# EAGLE design WifiTracker (EAGLE 9.3.2)
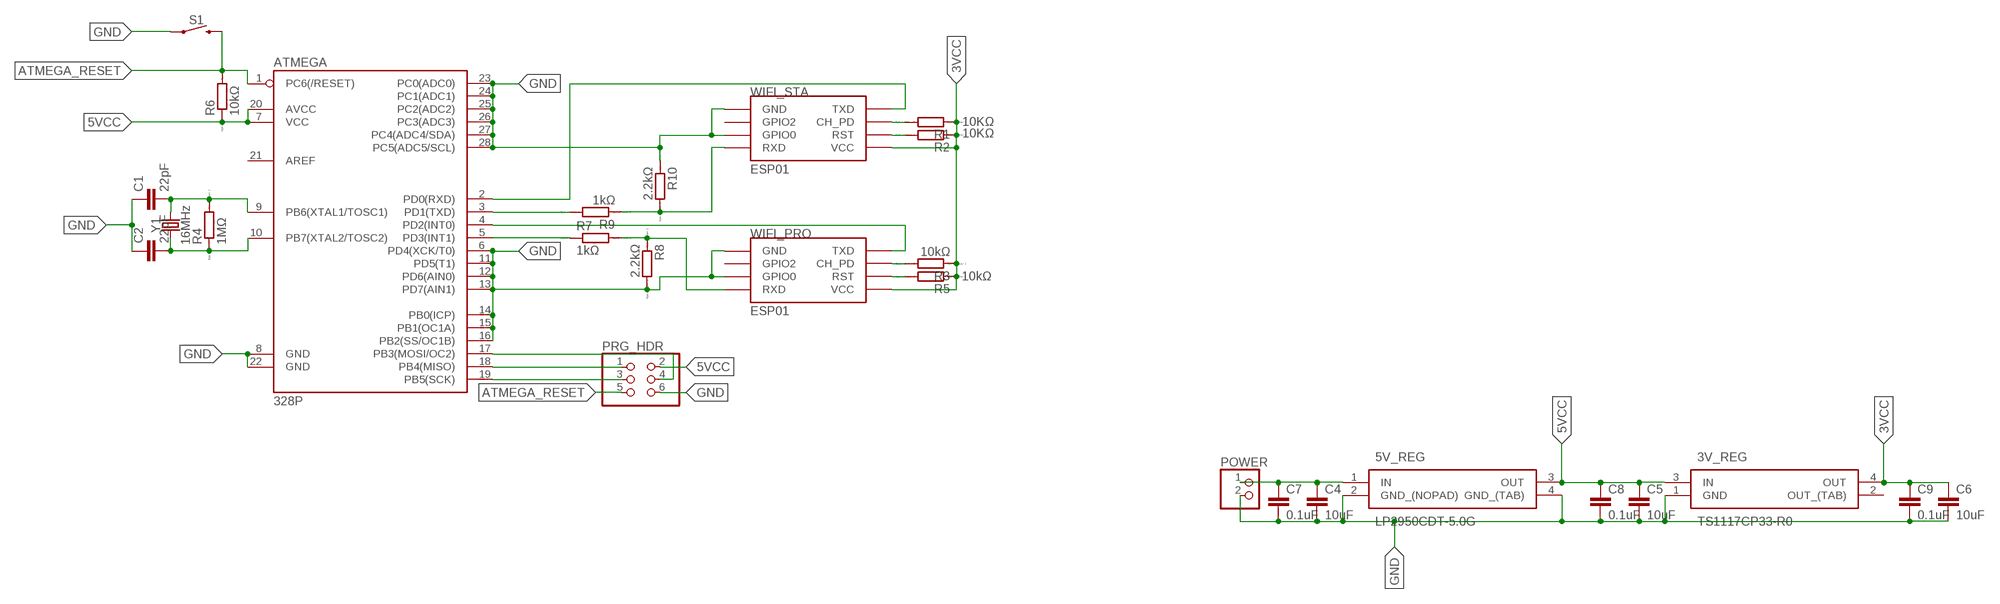
[diagram p0: schematic, sheet 1]

## Parts
3V_REG  TS1117CP33-R0  [TO229P990X238-4N]
5V_REG  LP2950CDT-5.0G  [TO229P990X238-4N]
ATMEGA  328P  ATMEGA328P_PDIP  [DIP28]
C1  22pF  1.0UF-1206-50V-10%  [1206]
C2  22pF  1.0UF-1206-50V-10%  [1206]
C4  10uF  1.0UF-1206-50V-10%  [1206]
C5  10uF  1.0UF-1206-50V-10%  [1206]
C6  10uF  1.0UF-1206-50V-10%  [1206]
C7  0.1uF  1.0UF-1206-50V-10%  [1206]
C8  0.1uF  1.0UF-1206-50V-10%  [1206]
C9  0.1uF  1.0UF-1206-50V-10%  [1206]
POWER  PINHD-1X2  [1X02]
PRG_HDR  PINHD-2X3  [2X03]
R1  10KΩ  RR1210  [R1210]
R2  10KΩ  RR1210  [R1210]
R3  10kΩ  RR1210  [R1210]
R4  1MΩ  RR1210  [R1210]
R5  10kΩ  RR1210  [R1210]
R6  10kΩ  RR1210  [R1210]
R7  1kΩ  RR1210  [R1210]
R8  2.2kΩ  RR1210  [R1210]
R9  1kΩ  RR1210  [R1210]
R10  2.2kΩ  RR1210  [R1210]
S1  MOMENTARY-SWITCH-SPST-PTH-6.0MM  [TACTILE_SWITCH_PTH_6.0MM]
WIFI_PRO  ESP01  [ESP01]
WIFI_STA  ESP01  [ESP01]
Y1  16MHz  CRYSTAL-8MHZSMD-HC49UP  [HC49UP]

## Nets
3VCC [power]: 3V_REG.4(OUT) C6.1 C9.1 R1.1 R2.1 R3.1 R5.1 WIFI_PRO.VCC WIFI_STA.VCC
5VCC [power]: 3V_REG.3(IN) 5V_REG.3(OUT) ATMEGA.7(VCC) ATMEGA.20(AVCC) C5.1 C8.1 PRG_HDR.2 R6.1
AT_STXD: ATMEGA.5(PD3(INT1)) R7.1
AT_TXD: ATMEGA.3(PD1(TXD)) R9.2
ATMEGA_RESET: ATMEGA.1(PC6(/RESET)) PRG_HDR.5 R6.2 S1.3
GND [power]: 3V_REG.1(GND) 5V_REG.2(GND_(NOPAD)) 5V_REG.4(GND_(TAB)) ATMEGA.6(PD4(XCK/T0)) ATMEGA.8(GND) ATMEGA.11(PD5(T1)) ATMEGA.12(PD6(AIN0)) ATMEGA.13(PD7(AIN1)) ATMEGA.14(PB0(ICP)) ATMEGA.15(PB1(OC1A)) ATMEGA.16(PB2(SS/OC1B)) ATMEGA.22(GND) ATMEGA.23(PC0(ADC0)) ATMEGA.24(PC1(ADC1)) ATMEGA.25(PC2(ADC2)) ATMEGA.26(PC3(ADC3)) ATMEGA.27(PC4(ADC4/SDA)) ATMEGA.28(PC5(ADC5/SCL)) C1.1 C2.1 C4.2 C5.2 C6.2 C7.2 C8.2 C9.2 POWER.2 PRG_HDR.6 R8.2 R10.1 S1.1 WIFI_PRO.GND WIFI_PRO.GPIO0 WIFI_STA.GND WIFI_STA.GPIO0
MISO: ATMEGA.18(PB4(MISO)) PRG_HDR.1
MOSI: ATMEGA.17(PB3(MOSI/OC2)) PRG_HDR.4
PRO_CH_PD: R3.2 WIFI_PRO.CH_PD
PRO_RST: R5.2 WIFI_PRO.RST
PRO_RXD: R7.2 R8.1 WIFI_PRO.RX(RXD)
PRO_TXD: ATMEGA.4(PD2(INT0)) WIFI_PRO.TX(TXD)
SCK: ATMEGA.19(PB5(SCK)) PRG_HDR.3
STA_CH_PD: R1.2 WIFI_STA.CH_PD
STA_RST: R2.2 WIFI_STA.RST
STA_RXD: R9.1 R10.2 WIFI_STA.RX(RXD)
STA_TXD: ATMEGA.2(PD0(RXD)) WIFI_STA.TX(TXD)
VIN [power]: 5V_REG.1(IN) C4.1 C7.1 POWER.1
XTAL1: ATMEGA.9(PB6(XTAL1/TOSC1)) C1.2 R4.2 Y1.2
XTAL2: ATMEGA.10(PB7(XTAL2/TOSC2)) C2.2 R4.1 Y1.1
Unconnected: 3V_REG.2(OUT_(TAB)) ATMEGA.21(AREF) WIFI_PRO.GPIO2 WIFI_STA.GPIO2

## Library data of the parts
3V_REG = TS1117CP33-R0:TS1117CP33-R0: Source: Datasheet <http://www.onsemi.com/pub/Collateral/LP2950-D.PDF>; ALLIED_NUMBER: 70100442; ALLIED_PRICE-STOCK: http://www.alliedelec.com/on-semiconductor-lp2950cdt-5-0g/70100442/; HEIGHT: 2.38mm; MANUFACTURER_NAME: ON Semiconductor; MANUFACTURER_PART_NUMBER: LP2950CDT-5.0G; MOUSER_PART_NUMBER: 863-LP2950CDT-5.0G; MOUSER_PRICE-STOCK: https://www.mouser.com/Search/Refine.aspx?Keyword=863-LP2950CDT-5.0G; RS_PART_NUMBER: 0463593P; RS_PRICE-STOCK: http://uk.rs-online.com/web/p/products/0463593P
5V_REG = LP2950CDT-5.0G:LP2950CDT-5.0G: Source: Datasheet <http://www.onsemi.com/pub/Collateral/LP2950-D.PDF>; ALLIED_NUMBER: 70100442; ALLIED_PRICE-STOCK: http://www.alliedelec.com/on-semiconductor-lp2950cdt-5-0g/70100442/; HEIGHT: 2.38mm; MANUFACTURER_NAME: ON Semiconductor; MANUFACTURER_PART_NUMBER: LP2950CDT-5.0G; MOUSER_PART_NUMBER: 863-LP2950CDT-5.0G; MOUSER_PRICE-STOCK: https://www.mouser.com/Search/Refine.aspx?Keyword=863-LP2950CDT-5.0G; RS_PART_NUMBER: 0463593P; RS_PRICE-STOCK: http://uk.rs-online.com/web/p/products/0463593P
ATMEGA = SparkFun-IC-Microcontroller:ATMEGA328P_PDIP: Atmel 328P Through hole ATMEGA328P uC used in the Arduino 32kb flash, 1k EEPROM, 2k SRAM Datasheet <http://www.sparkfun.com/datasheets/Components/SMD/ATMega328.pdf> SparkFun Products Storefront component: AVR 28 Pin 20MHz 32K 6A/D - ATMega328P <https://www.sparkfun.com/products/9061> (COM-09061) SparkFun Simon Says - Through-Hole Soldering Kit <https://www.sparkfun.com/products/10547> (KIT-10547) SparkFun Learn to Solder - Simon Says <https://www.sparkfun.com/products/13708> (KIT-13708) SparkFun BigTime Watch Kit <https://www.sparkfun.com/products/11734> (KIT-11734) SparkFun ClockIt <https://www.sparkfun.com/products/10930> (KIT-10930) SparkFun Serial Enabled LCD Kit <https://www.sparkfun.com/products/10097> (LCD-10097) SparkFun Simon Tilts - Through Hole Soldering Kit <https://www.sparkfun.com/products/12634> (KIT-12634) SparkFun Frequency Counter Kit <https://www.sparkfun.com/products/10140> (KIT-10140) FabFM Radio Kit <https://www.sparkfun.com/products/11043> (KIT-11043) SparkFun Binary Blaster Kit <https://www.sparkfun.com/products/12037> (KIT-12037) SparkFun Metro-Gnome <https://www.sparkfun.com/products/9236> (KIT-09236) ATmega328 with Arduino Optiboot (Uno) <https://www.sparkfun.com/products/10524> (DEV-10524); PROD_ID: IC-09136
C1 C2 C4-C9 = SparkFun-Capacitors:1.0UF: 1µF ceramic capacitors A capacitor is a passive two-terminal electrical component used to store electrical energy temporarily in an electric field.; PROD_ID: CAP-09822; VALUE: 1.0uF
POWER = pinhead:PINHD-1X2: PIN HEADER
PRG_HDR = pinhead:PINHD-2X3: PIN HEADER
R1-R10 = eagle-ltspice:R: RESISTOR, European symbol; SPICEMODEL: NONE; SPICEPREFIX: R
S1 = SparkFun-Switches:MOMENTARY-SWITCH-SPST: Momentary Switch (Pushbutton) - SPST Normally-open (NO) SPST momentary switches (buttons, pushbuttons). Variants PTH-12MM - 12mm square, through-hole Momentary Pushbutton Switch - 12mm Square <https://www.sparkfun.com/products/9190> (COM-09190) PTH-6.0MM, PTH-6.0MM-KIT - 6.0mm square, through-hole Mini Pushbutton Switch <https://www.sparkfun.com/products/97> (COM-00097) KIT package intended for soldering kit's - only one side of pads' copper is exposed. PTH-RIGHT-ANGLE-KIT - Right-angle, through-hole Right Angle Tactile Button <https://www.sparkfun.com/products/10791> - Used on SparkFun BigTime Watch Kit <https://www.sparkfun.com/products/11734> SMD-12MM - 12mm square, surface-mount Tactile Button - SMD (12mm) <https://www.sparkfun.com/products/12993> (COM-12993) Used on SparkFun PicoBoard <https://www.sparkfun.com/products/11888> SMD-4.5MM - 4.5mm Square Trackball Switch Used on SparkFun Blackberry Trackballer Breakout <https://www.sparkfun.com/products/13169> SMD-4.6MMX2.8MM - 4.60mm x 2.80mm, surface mount Used on SparkFun SAMD21 Mini Breakout <https://www.sparkfun.com/products/13664> SMD-5.2MM, SMD-5.2-REDUNDANT - 5.2mm square, surface-mount Mini Pushbutton Switch - SMD <https://www.sparkfun.com/products/8720> (COM-08720) Used on Arduino Pro Mini <https://www.sparkfun.com/products/11114> REDUNDANT package connects both switch circuits together SMD-6.0X3.5MM - 6.0 x 3.5mm, surface mount Momentary Reset Switch SMD <https://www.sparkfun.com/products/8229> (COM-08229) SMD-6.2MM-TALL - 6.2mm square, surface mount Tactile Button - SMD (6mm) <https://www.sparkfun.com/products/12992> Used on SparkFun Digital Sandbox <https://www.sparkfun.com/products/12651> SMD-RIGHT-ANGLE - Right-angle, surface mount Used on SparkFun Block for Intel® Edison - Arduino <https://www.sparkfun.com/products/13036>; PROD_ID: SWCH-08441; SF_SKU: COM-00097
WIFI_PRO WIFI_STA = esp8266modules:ESP01: ESP8266 Wifi module 01
Y1 = SparkFun-Clocks:CRYSTAL-8MHZ: 8MHz Crystal Datasheet Example <http://www.futureelectronics.com/en/technologies/electromechanical/timing-devices/crystals/Pages/6008189-ABM3B-8.000MHZ-B2-T.aspx?IM=0> Frequency: 8MHz Frequency Tolerance: ±20ppm Load Capacitance: 18pF SparkFun Products: Pro Micro -3.3V/8MHz <https://www.sparkfun.com/products/12587> WAV Trigger <https://www.sparkfun.com/products/13660>; PROD_ID: XTAL-11706; VALUE: 8MHz

## Net classes
0 default: width 0.406 mm, drill 0.203 mm, clearance 0.203 mm
1 power: width 0.813 mm, drill 0.203 mm, clearance 0.203 mm
2 text: width 0.203 mm, drill 0.203 mm, clearance 0.203 mm

## Board
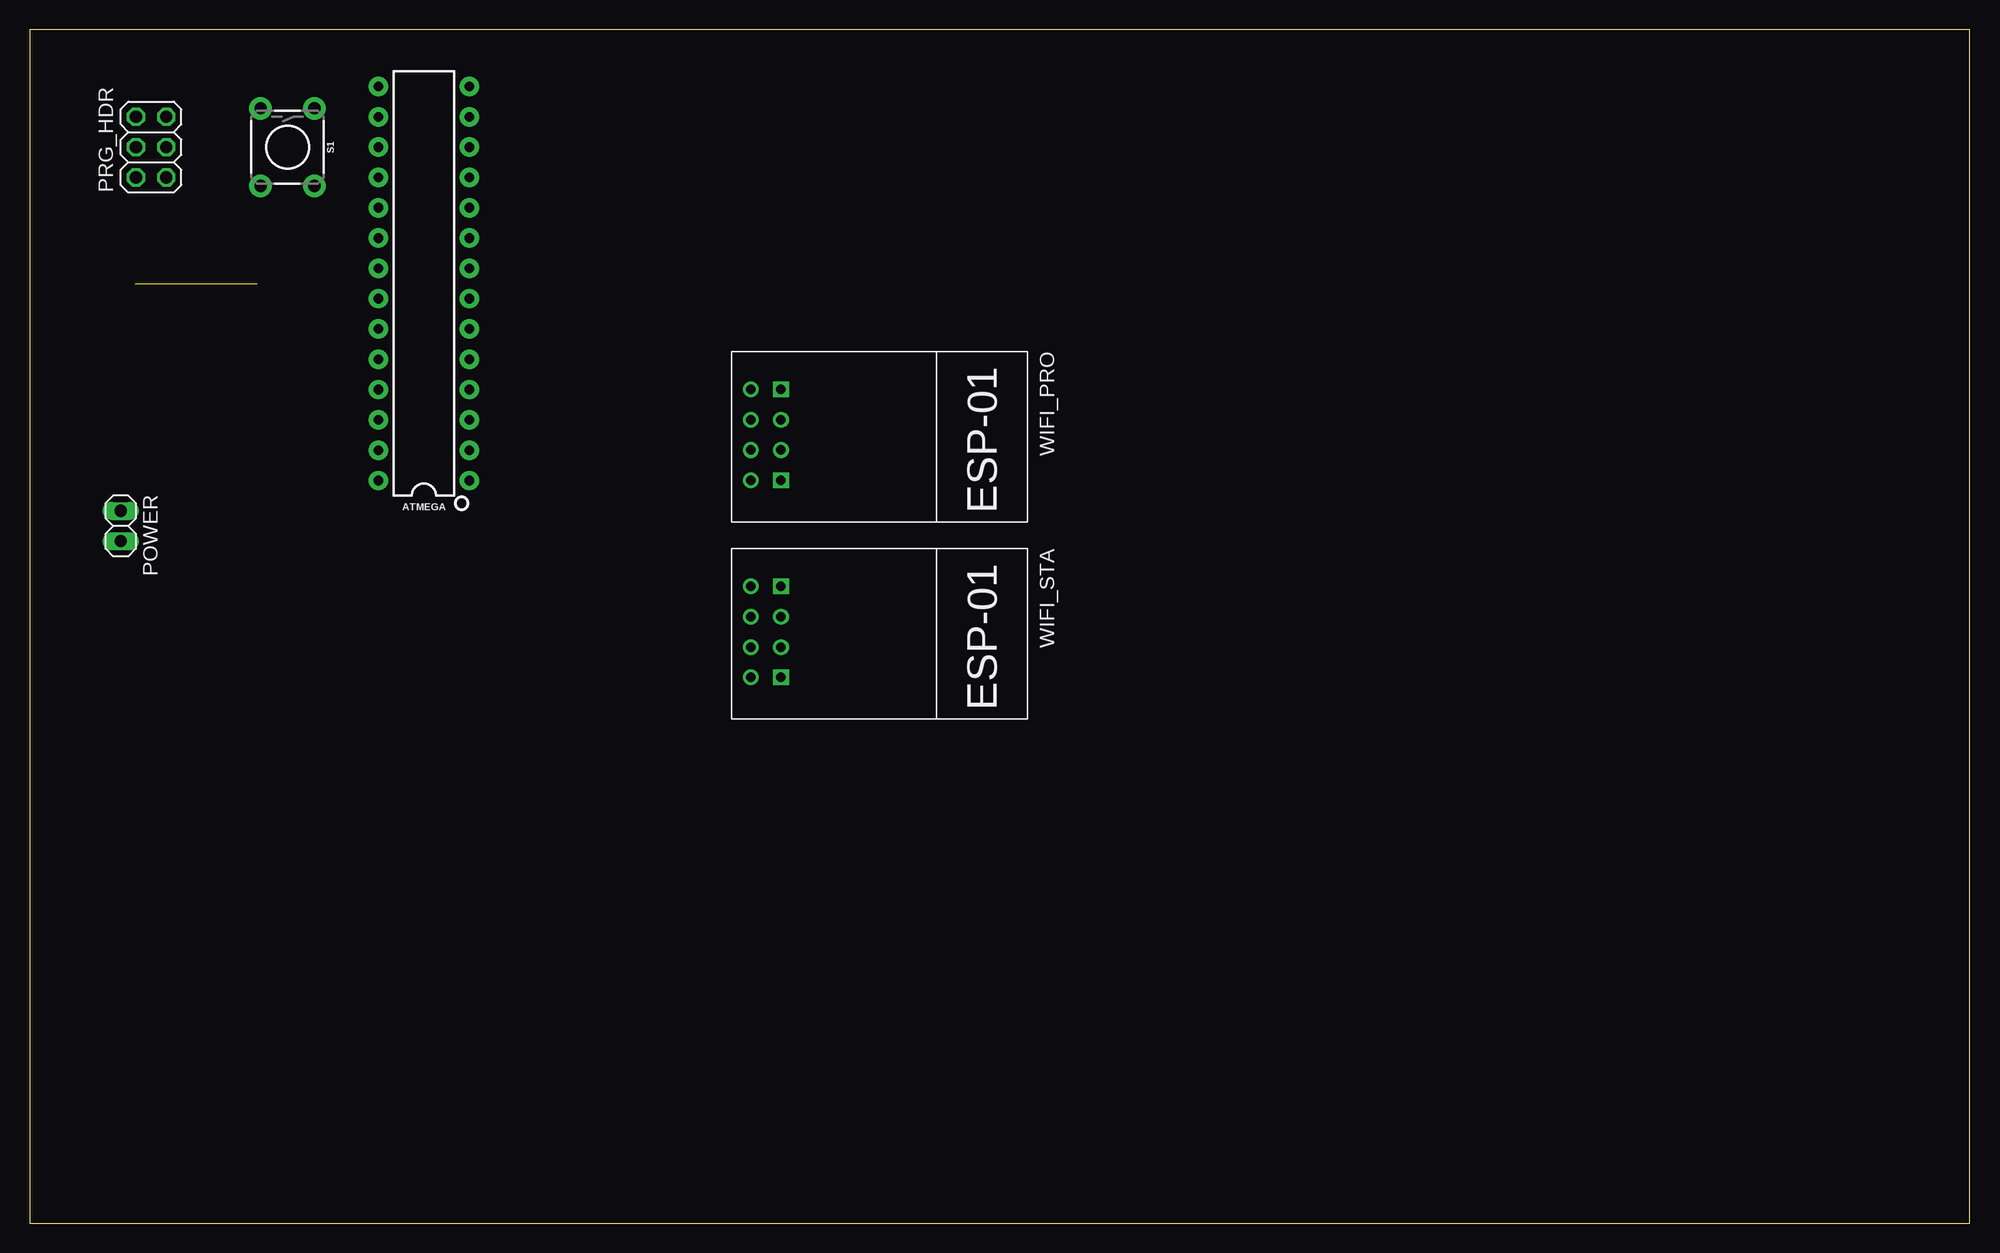
[diagram p1: board, top side]
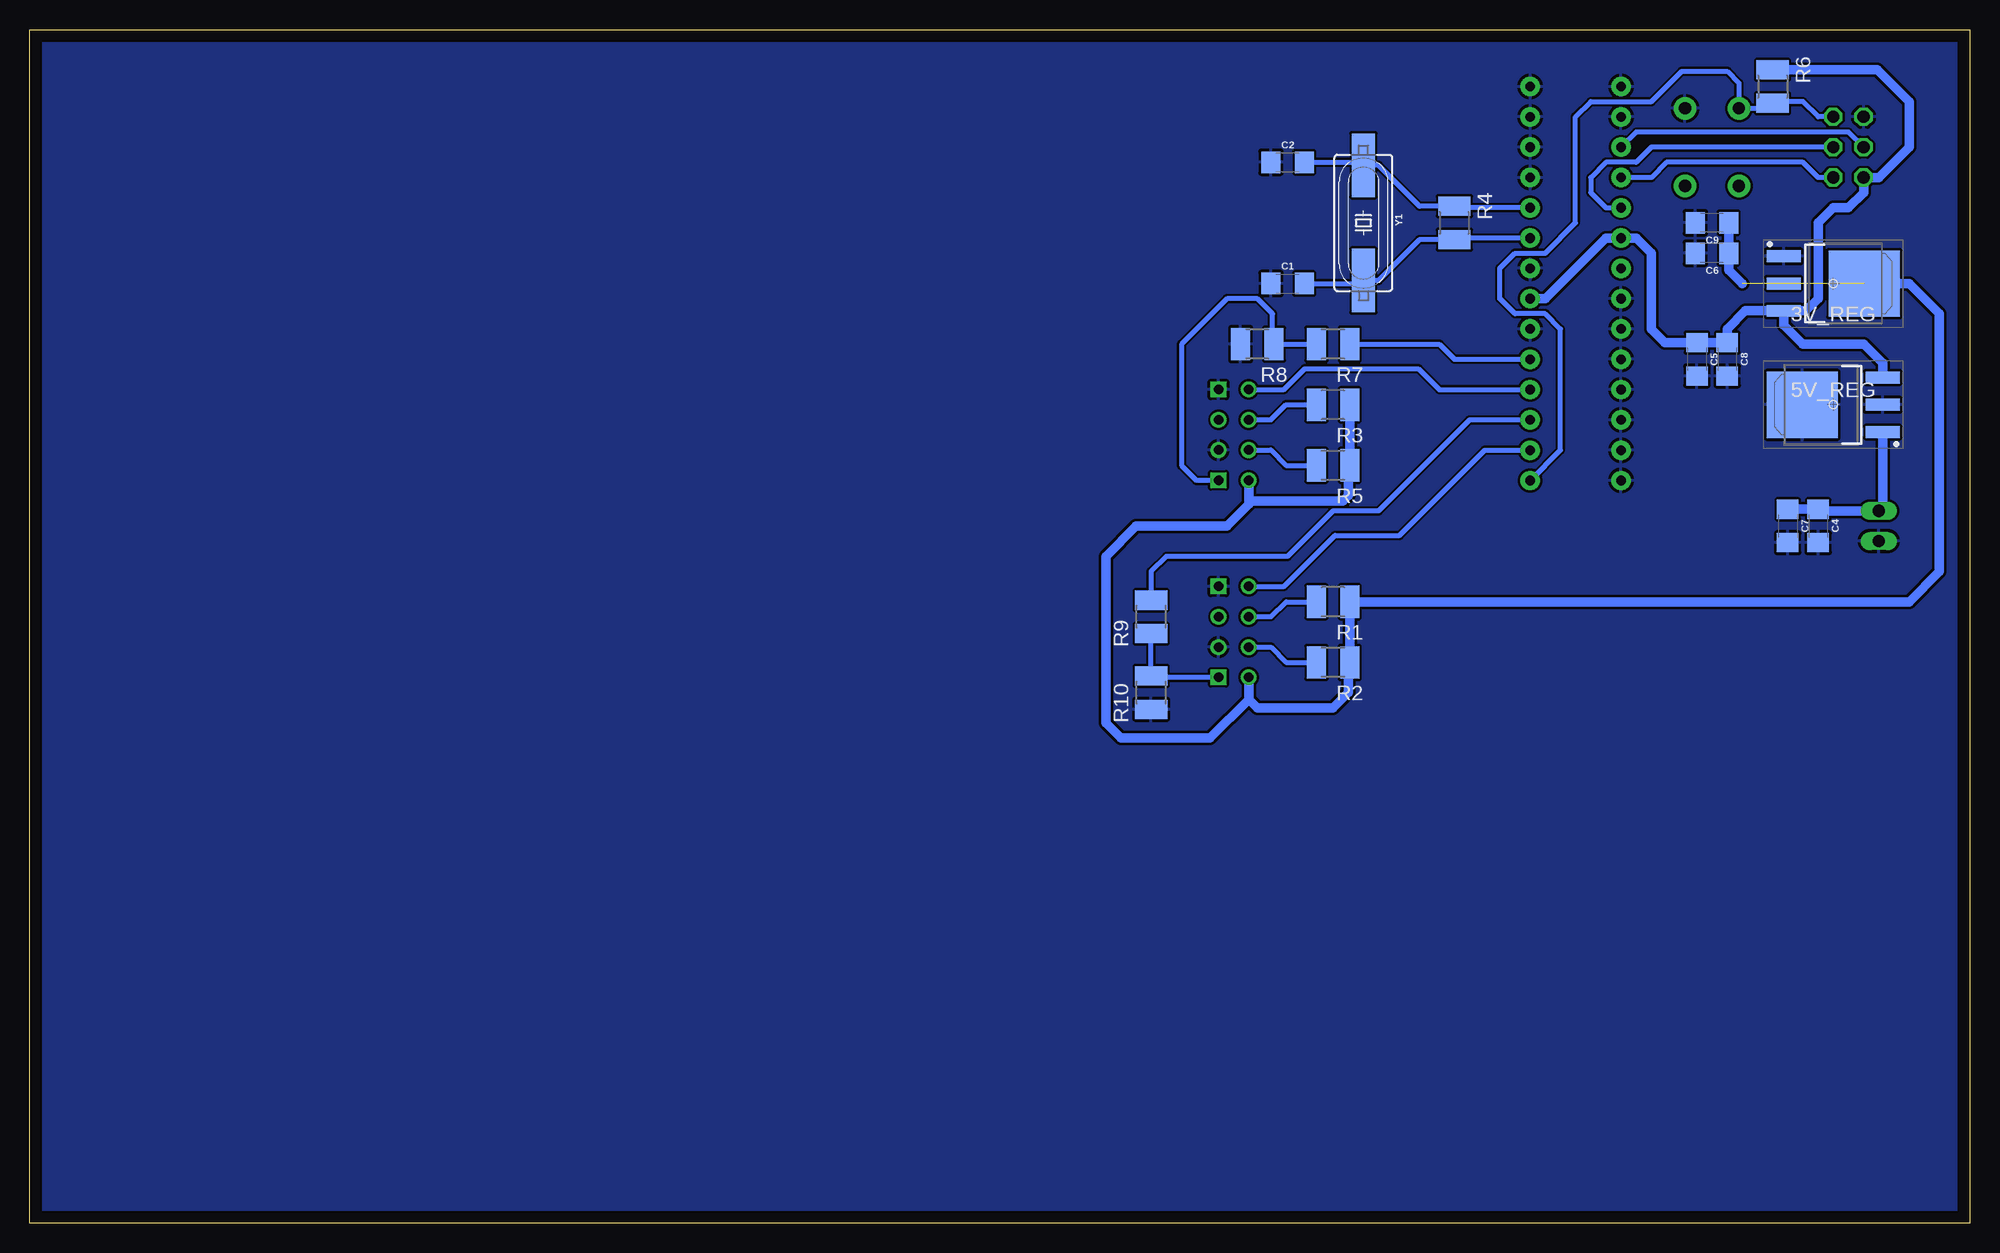
[diagram p2: board, bottom side, seen from below]

Size 162.54 x 100 mm. Coordinates in mm from the lower left corner, seen from the top.
Outline: 0,0 162.54,0 162.54,100 0,100 0,0
Copper layers (1*16): Top 0.035mm / dielectric 1.5mm / Bottom 0.035mm
Design rules "default": minimum track width 6mil, minimum drill 0.35mm, track to track 6mil, track to pad 6mil, pad to pad 6mil, via to via 6mil, smd to smd 6mil, copper to edge 40mil, drill to drill 6mil, minimum pad ring 10mil, minimum via ring 8mil, stop-mask expansion 4mil, vias tented up to drill 0mil, thermal gap 10mil

### Footprints (pad centres in the part's own frame; a part is rotated, then mirrored left to right if it is on the bottom)
TO229P990X238-4N = smd 2.85 x 1: 1 -4.15,2.29; 2 -4.15,0; 3 -4.15,-2.29 | smd 5.95 x 5.55: 4 2.6,0
DIP28 = drill 0.813 pad 1.626: 1 -16.51,-3.81; 2 -13.97,-3.81; 3 -11.43,-3.81; 4 -8.89,-3.81; 5 -6.35,-3.81; 6 -3.81,-3.81; 7 -1.27,-3.81; 8 1.27,-3.81; 9 3.81,-3.81; 10 6.35,-3.81; 11 8.89,-3.81; 12 11.43,-3.81; 13 13.97,-3.81; 14 16.51,-3.81; 15 16.51,3.81; 16 13.97,3.81; 17 11.43,3.81; 18 8.89,3.81; 19 6.35,3.81; 20 3.81,3.81; 21 1.27,3.81; 22 -1.27,3.81; 23 -3.81,3.81; 24 -6.35,3.81; 25 -8.89,3.81; 26 -11.43,3.81; 27 -13.97,3.81; 28 -16.51,3.81
1206 = smd 1.6 x 1.8: 1 -1.4,0; 2 1.4,0
1X02 = drill 1.016 long: 1 -1.27,0; 2 1.27,0
2X03 = drill 1.016 octagon: 1 -2.54,-1.27; 2 -2.54,1.27; 3 0,-1.27; 4 0,1.27; 5 2.54,-1.27; 6 2.54,1.27
R1210 = smd 1.6 x 2.7: 1 -1.4,0; 2 1.4,0
TACTILE_SWITCH_PTH_6.0MM = drill 1.016 pad 1.88: 1 -3.251,2.261; 2 3.251,2.261; 3 -3.251,-2.261; 4 3.251,-2.261
ESP01 = drill 0.8: CH_PD -1.285,-8.178; GPIO0 1.255,-5.638; GPIO2 -1.285,-5.638; RST 1.255,-8.178; TX -3.825,-8.178; VCC 3.795,-8.178 | drill 0.8 square: GND -3.825,-5.638; RX 3.795,-5.638
HC49UP = smd 5.334 x 1.93: 1 -4.826,0; 2 4.826,0

### Placement (x,y rotation side)
3V_REG  11.43,78.74 0 bottom
5V_REG  11.43,68.58 180 bottom
ATMEGA  33.02,78.74 90 top
C1  57.15,78.74 0 bottom
C2  57.15,88.9 0 bottom
C4  12.7,58.42 270 bottom
C5  22.86,72.39 270 bottom
C6  21.59,81.28 180 bottom
C7  15.24,58.42 270 bottom
C8  20.32,72.39 270 bottom
C9  21.59,83.82 180 bottom
POWER  7.62,58.42 270 top
PRG_HDR  10.16,90.17 90 top
R1  53.34,52.07 180 bottom
R2  53.34,46.99 180 bottom
R3  53.34,68.58 180 bottom
R4  43.18,83.82 270 bottom
R5  53.34,63.5 180 bottom
R6  16.51,95.25 270 bottom
R7  53.34,73.66 180 bottom
R8  59.69,73.66 180 bottom
R9  68.58,50.8 90 bottom
R10  68.58,44.45 90 bottom
S1  21.59,90.17 270 top
WIFI_PRO  68.58,66.04 270 top
WIFI_STA  68.58,49.53 270 top
Y1  50.8,83.82 270 bottom

### Tracks (layer width: path | path; a pad name or v marks a point on that pad's centre or on a via)
3VCC  (1 unrouted)
  Bottom 0.813: 19.05,78.74 20.19,79.88 C6.1 C9.1 | 3V_REG.4 5.08,78.74 2.54,76.2 2.54,54.61 5.08,52.07 R1.1 R2.1 52.07,46.86 52.07,44.45 53.34,43.18 59.69,43.18 60.4,43.89 | WIFI_STA.VCC 60.4,43.89 | 60.4,43.89 63.66,40.64 71.12,40.64 72.39,41.91 72.39,55.88 69.85,58.42 62.23,58.42 60.4,60.25 | 60.4,60.25 WIFI_PRO.VCC | 60.4,60.25 60.15,60.5 52.53,60.5 52.07,60.96 52.07,63.37 R5.1 R3.1
5VCC
  Bottom 0.813: 3V_REG.3 15.58,75.27 13.97,73.66 8.89,73.66 7.28,72.05 5V_REG.3 | 20.19,73.79 C8.1 | C8.1 C5.1 25.53,73.79 26.67,74.93 26.67,81.28 27.94,82.55 ATMEGA.20 30.48,82.55 35.56,77.47 ATMEGA.7 | C8.1 20.32,74.93 18.8,76.45 3V_REG.3 | R6.1 7.75,96.65 5.08,93.98 5.08,90.17 7.62,87.63 PRG_HDR.2 8.89,86.36 10.16,85.09 11.43,85.09 12.7,83.82 12.7,77.47 13.72,76.45 3V_REG.3
AT_STXD
  Bottom 0.406: R7.1 44.45,73.66 43.18,72.39 ATMEGA.5
AT_TXD
  Bottom 0.406: ATMEGA.3 41.91,67.31 49.53,59.69 53.34,59.69 57.15,55.88 67.31,55.88 68.58,54.61 R9.2
ATMEGA_RESET
  Bottom 0.406: PRG_HDR.5 12.7,92.71 13.97,93.98 16.38,93.98 R6.2 16.51,93.7 16.79,93.42 S1.3 19.33,95.53 20.32,96.52 24.13,96.52 26.67,93.98 31.75,93.98 33.02,92.71 33.02,83.82 35.56,81.28 38.1,81.28 39.37,80.01 39.37,77.47 38.1,76.2 35.56,76.2 34.29,74.93 34.29,64.77 ATMEGA.1
GND
  pour Bottom: -1.27,101.6 163.83,101.6 163.83,-2.54 -1.27,-2.54
MISO
  Bottom 0.406: PRG_HDR.1 12.7,87.63 13.97,88.9 25.4,88.9 26.67,87.63 ATMEGA.18
MOSI
  Bottom 0.406: PRG_HDR.4 10.16,91.44 27.94,91.44 ATMEGA.17
PRO_CH_PD
  Bottom 0.406: WIFI_PRO.CH_PD 58.53,67.33 57.28,68.58 R3.2
PRO_RST
  Bottom 0.406: WIFI_PRO.RST 58.56,64.78 57.28,63.5 R5.2
PRO_RXD
  Bottom 0.406: R7.2 R8.1 58.42,73.79 58.42,76.2 59.69,77.47 62.23,77.47 66.04,73.66 66.04,63.5 64.78,62.24 WIFI_PRO.RX
PRO_TXD
  Bottom 0.406: WIFI_PRO.TX 57.45,69.86 55.71,71.61 46.21,71.61 44.45,69.85 ATMEGA.4
SCK
  Bottom 0.406: ATMEGA.19 30.48,85.09 31.75,86.36 31.75,87.63 30.48,88.9 27.94,88.9 26.67,90.17 PRG_HDR.3
STA_CH_PD
  Bottom 0.406: WIFI_STA.CH_PD 58.53,50.81 57.28,52.07 R1.2
STA_RST
  Bottom 0.406: WIFI_STA.RST 58.56,48.27 57.28,46.99 R2.2
STA_RXD
  Bottom 0.406: WIFI_STA.RX 68.47,45.73 R10.2 R9.1
STA_TXD
  Bottom 0.406: ATMEGA.2 40.64,64.77 47.77,57.64 53.17,57.64 57.45,53.35 WIFI_STA.TX
VIN
  Bottom 0.813: 5V_REG.1 7.28,60.03 POWER.1 12.57,59.69 C4.1 C7.1
XTAL1
  Bottom 0.406: ATMEGA.9 43.05,82.55 R4.2 46.1,82.42 49.53,78.99 Y1.2 51.05,78.74 C1.2
XTAL2
  Bottom 0.406: ATMEGA.10 43.18,85.09 R4.1 46.1,85.22 49.53,88.65 Y1.1 51.05,88.9 C2.2